# EAGLE schematic Z_sim_v2 (EAGLE 6.5.0)
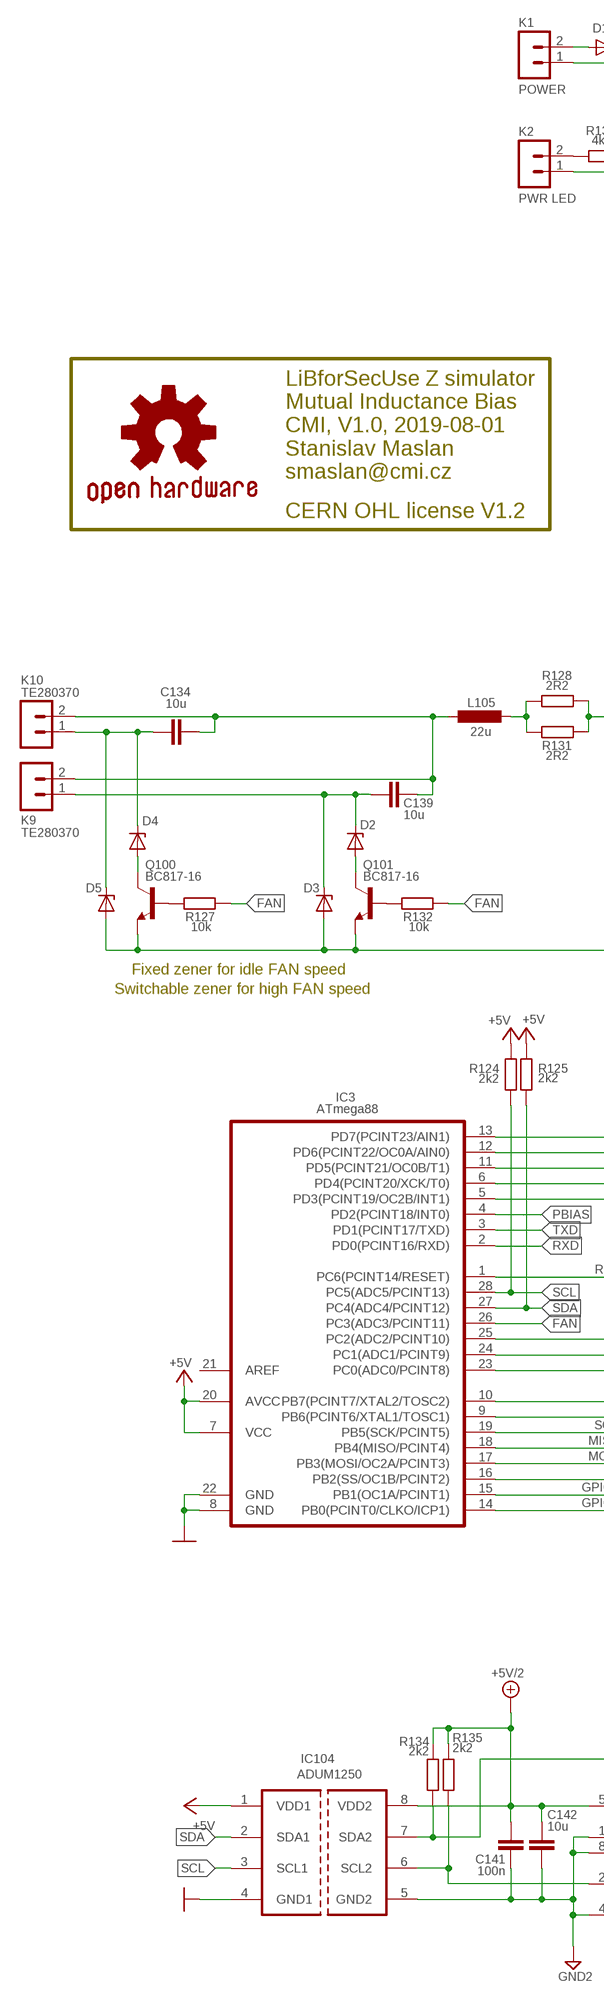
[diagram p0: schematic, sheet 1, part 1 of 2]
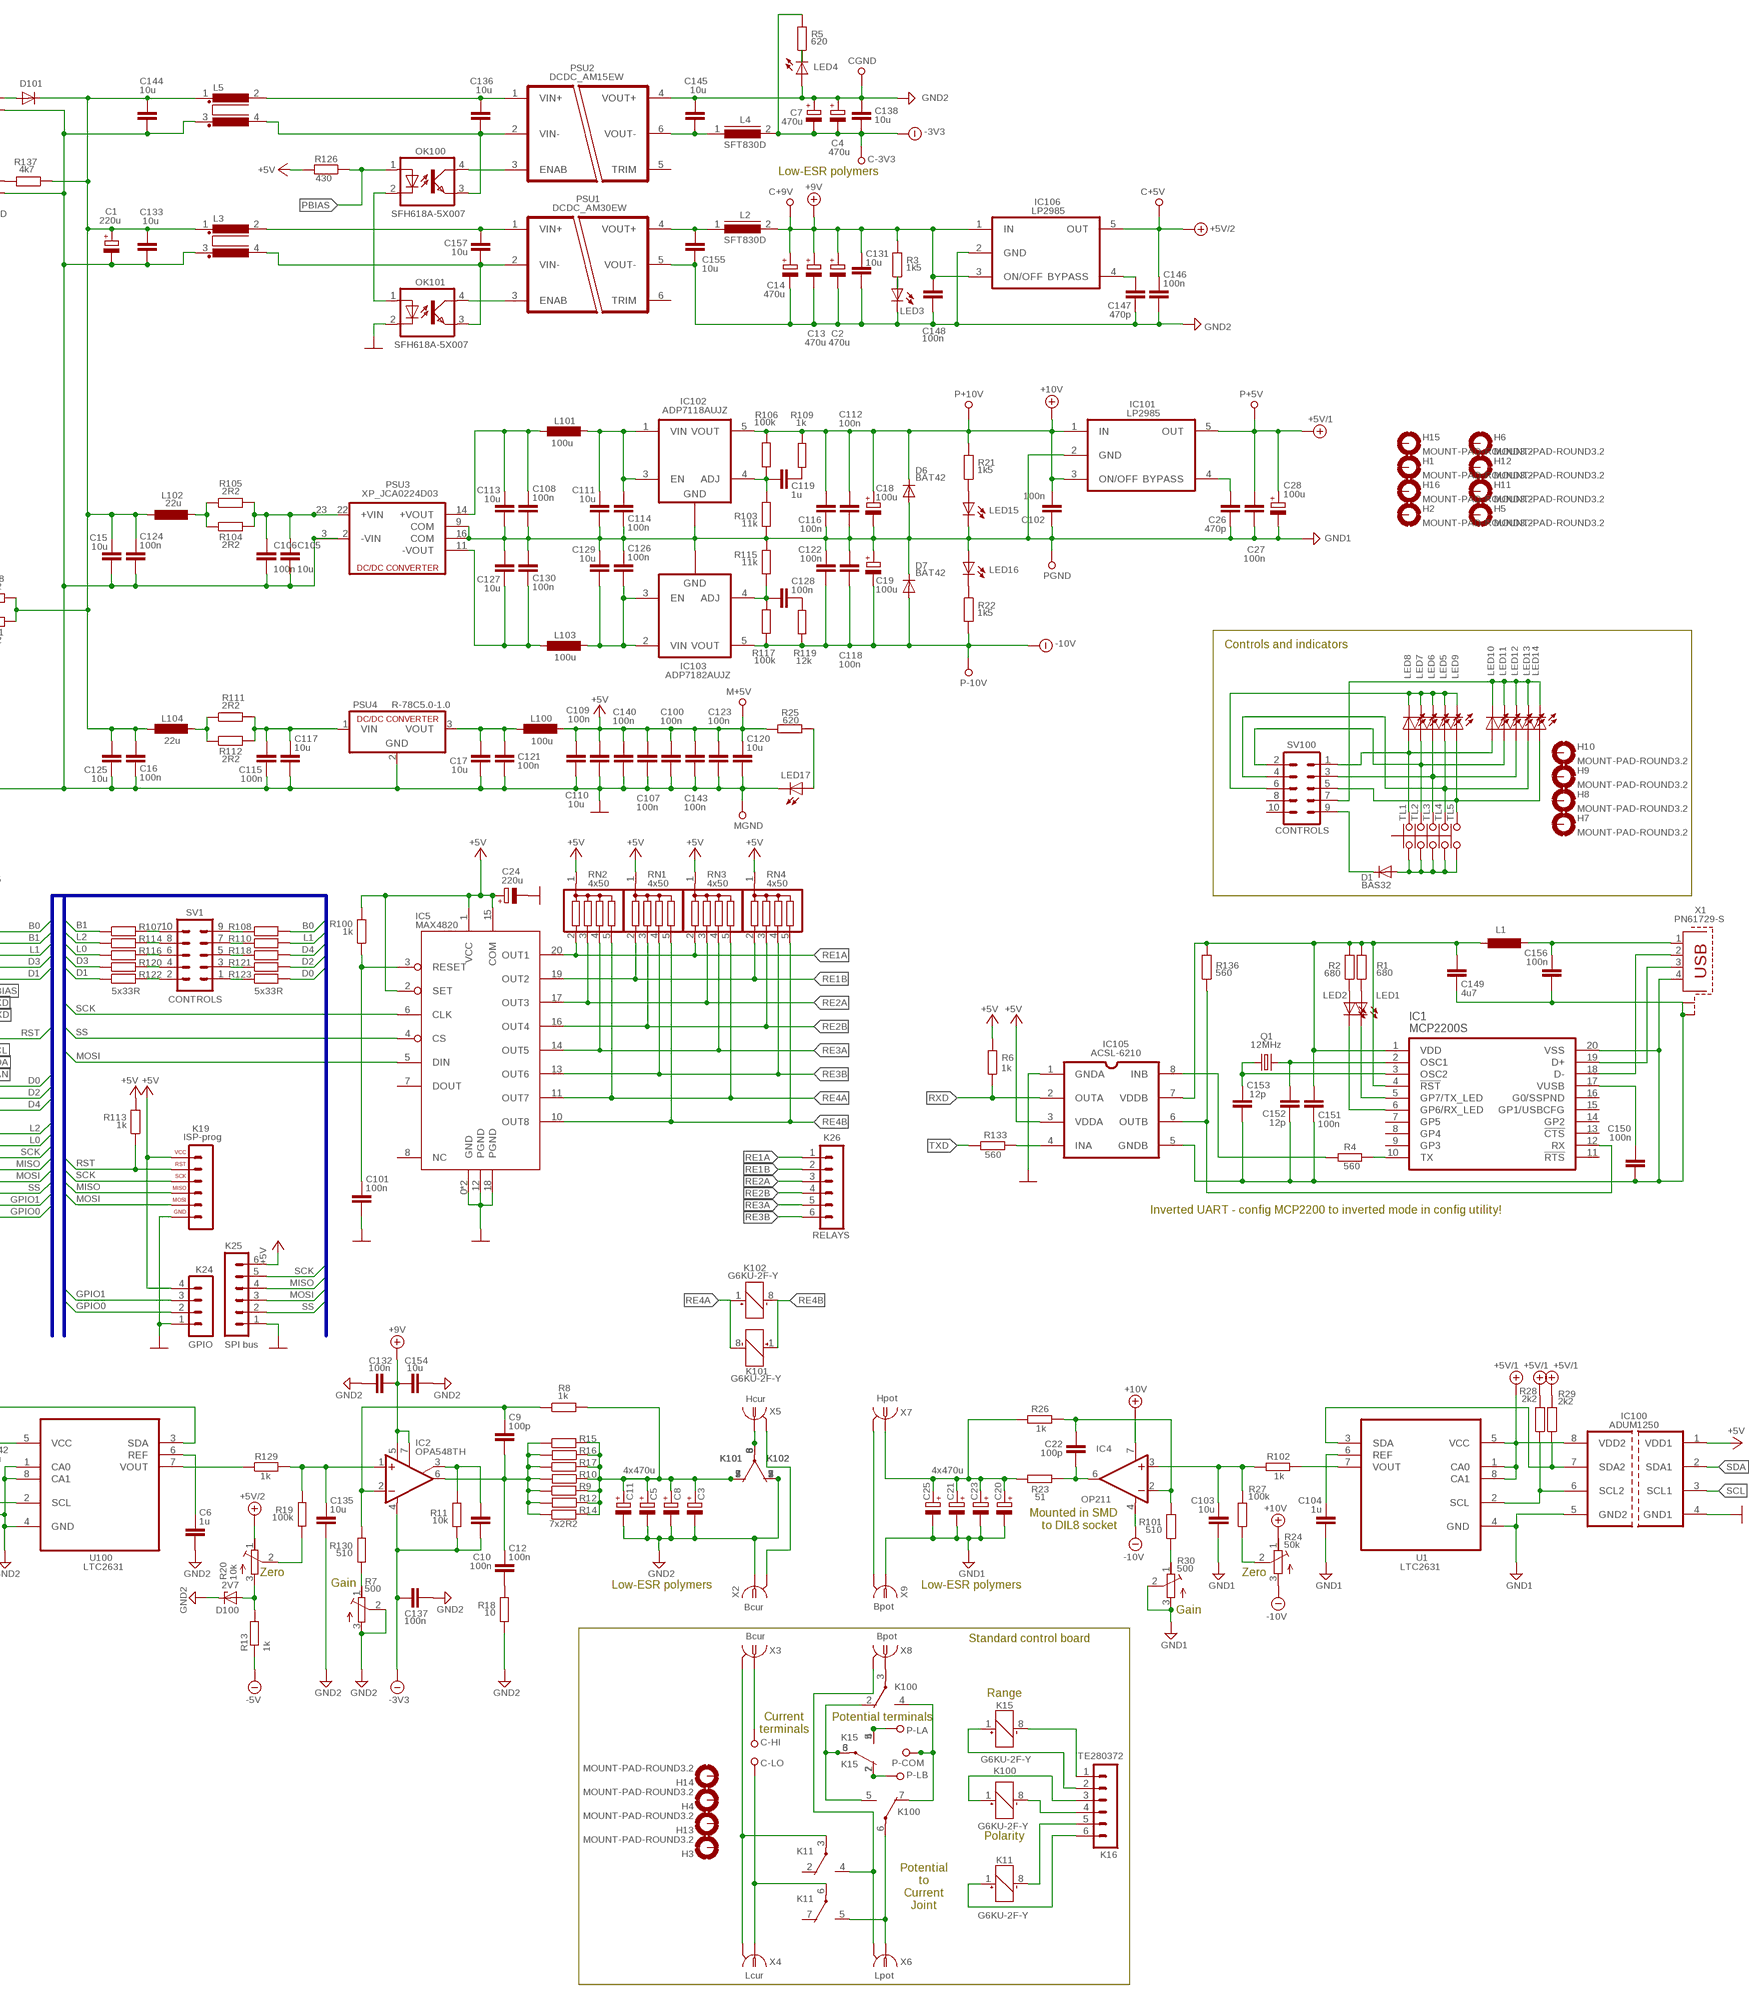
[diagram p1: schematic, sheet 1, part 2 of 2]

## Parts
C1  220u  CPOL-EUE3.5-8  [E3,5-8]
C2  470u  CPOL-EUE3.5-8  [E3,5-8]
C3  CPOL-EUE3.5-8  [E3,5-8]
C4  470u  CPOL-EUE3.5-8  [E3,5-8]
C5  CPOL-EUE3.5-8  [E3,5-8]
C6  1u  C-EUX0805  [X0805]
C7  470u  CPOL-EUE3.5-8  [E3,5-8]
C8  CPOL-EUE3.5-8  [E3,5-8]
C9  100p  C-EU025-024X044  [C025-024X044]
C10  100n  C-EUX0805  [X0805]
C11  4x470u  CPOL-EUE3.5-8  [E3,5-8]
C12  100n  C-EU050-024X044  [C050-024X044]
C13  470u  CPOL-EUE3.5-8  [E3,5-8]
C14  470u  CPOL-EUE3.5-8  [E3,5-8]
C15  10u  C-EUC1210K  [C1210K]
C16  100n  C-EUX0805  [X0805]
C17  10u  C-EUC1210K  [C1210K]
C18  100u  CPOL-EUE2.5-6  [E2,5-6]
C19  100u  CPOL-EUE2.5-6  [E2,5-6]
C20  CPOL-EUE3.5-8  [E3,5-8]
C21  CPOL-EUE3.5-8  [E3,5-8]
C22  100p  C-EU025-024X044  [C025-024X044]
C23  CPOL-EUE3.5-8  [E3,5-8]
C24  220u  CPOL-EUE3.5-8  [E3,5-8]
C25  4x470u  CPOL-EUE3.5-8  [E3,5-8]
C26  470p  C-EUX0805  [X0805]
C27  100n  C-EUX0805  [X0805]
C28  100u  CPOL-EUE2.5-6  [E2,5-6]
C100  100n  C-EUX0805  [X0805]
C101  100n  C-EUX0805  [X0805]
C102  100n  C-EUX0805  [X0805]
C103  10u  C-EUC1210K  [C1210K]
C104  1u  C-EUX0805  [X0805]
C105  10u  C-EUC1210K  [C1210K]
C106  100n  C-EUX0805  [X0805]
C107  100n  C-EUX0805  [X0805]
C108  100n  C-EUX0805  [X0805]
C109  100n  C-EUX0805  [X0805]
C110  10u  C-EUC1210K  [C1210K]
C111  10u  C-EUC1210K  [C1210K]
C112  100n  C-EUX0805  [X0805]
C113  10u  C-EUC1210K  [C1210K]
C114  100n  C-EUX0805  [X0805]
C115  100n  C-EUX0805  [X0805]
C116  100n  C-EUX0805  [X0805]
C117  10u  C-EUC1210K  [C1210K]
C118  100n  C-EUX0805  [X0805]
C119  1u  C-EUX0805  [X0805]
C120  10u  C-EUC1210K  [C1210K]
C121  100n  C-EUX0805  [X0805]
C122  100n  C-EUX0805  [X0805]
C123  100n  C-EUX0805  [X0805]
C124  100n  C-EUX0805  [X0805]
C125  10u  C-EUC1210K  [C1210K]
C126  100n  C-EUX0805  [X0805]
C127  10u  C-EUC1210K  [C1210K]
C128  100n  C-EUX0805  [X0805]
C129  10u  C-EUC1210K  [C1210K]
C130  100n  C-EUX0805  [X0805]
C131  10u  C-EUC1210K  [C1210K]
C132  100n  C-EUX0805  [X0805]
C133  10u  C-EUC1210K  [C1210K]
C134  10u  C-EUC1210K  [C1210K]
C135  10u  C-EUC1210K  [C1210K]
C136  10u  C-EUC1210K  [C1210K]
C137  100n  C-EUX0805  [X0805]
C138  10u  C-EUC1210K  [C1210K]
C139  10u  C-EUC1210K  [C1210K]
C140  100n  C-EUX0805  [X0805]
C141  100n  C-EUX0805  [X0805]
C142  10u  C-EUC1210K  [C1210K]
C143  100n  C-EUX0805  [X0805]
C144  10u  C-EUC1210K  [C1210K]
C145  10u  C-EUC1210K  [C1210K]
C146  100n  C-EUX0805  [X0805]
C147  470p  C-EUX0805  [X0805]
C148  100n  C-EUX0805  [X0805]
C149  4u7  C-EUC1210K  [C1210K]
C150  100n  C0805  [X0805]
C151  100n  C0805  [X0805]
C152  12p  C0805  [X0805]
C153  12p  C0805  [X0805]
C154  10u  C-EUC1210K  [C1210K]
C155  10u  C-EUC1210K  [C1210K]
C156  100n  C0805  [X0805]
C157  10u  C-EUC1210K  [C1210K]
C+5V  SPL  [SP]
C+9V  SPL  [SP]
C-3V3  SPL  [SP]
C-HI  FAST28R  [FAST28_R]
C-LO  FAST28R  [FAST28_R]
CGND  SPL  [SP]
D1  BAS32  [SOD80C]
D2  ZENER-DIODEZD-2.5  [ZDIO-2.5]
D3  ZENER-DIODEZD-2.5  [ZDIO-2.5]
D4  ZENER-DIODEZD-2.5  [ZDIO-2.5]
D5  ZENER-DIODEZD-2.5  [ZDIO-2.5]
D6  BAT42  DIODE-SOD80C  [SOD80C]
D7  BAT42  DIODE-SOD80C  [SOD80C]
D100  2V7  ZENER-DIODESOD80C  [SOD80C]
D101  DIODE-MELF-MLL41  [MELF-MLL41]
GOLD_ORB_SM1  OSHWLOGO_GOLD_ORB_MED  [OSHW1]
H1  MOUNT-PAD-ROUND3.2  [3,2-PAD]
H2  MOUNT-PAD-ROUND3.2  [3,2-PAD]
H3  MOUNT-PAD-ROUND3.2  [3,2-PAD]
H4  MOUNT-PAD-ROUND3.2  [3,2-PAD]
H5  MOUNT-PAD-ROUND3.2  [3,2-PAD]
H6  MOUNT-PAD-ROUND3.2  [3,2-PAD]
H7  MOUNT-PAD-ROUND3.2  [3,2-PAD]
H8  MOUNT-PAD-ROUND3.2  [3,2-PAD]
H9  MOUNT-PAD-ROUND3.2  [3,2-PAD]
H10  MOUNT-PAD-ROUND3.2  [3,2-PAD]
H11  MOUNT-PAD-ROUND3.2  [3,2-PAD]
H12  MOUNT-PAD-ROUND3.2  [3,2-PAD]
H13  MOUNT-PAD-ROUND3.2  [3,2-PAD]
H14  MOUNT-PAD-ROUND3.2  [3,2-PAD]
H15  MOUNT-PAD-ROUND3.2  [3,2-PAD]
H16  MOUNT-PAD-ROUND3.2  [3,2-PAD]
IC1  MCP2200S  [SOIC20W]
IC2  OPA548TH  [TO220-7H]
IC3  ATmega88  ATMEGA88P  [DIL28]
IC4  OP211  OPA650P  [DIL08]
IC5  MAX4820  MAX4820_TSSOP  [TSSOP20]
IC100  ADUM1250  [SO8]
IC101  LP2985  [SOT23-5]
IC102  ADP7118AUJZ  [SOT23-5]
IC103  ADP7182AUJZ  [SOT23-5]
IC104  ADUM1250  [SO8]
IC105  ACSL-6210  [SO8]
IC106  LP2985  [SOT23-5]
K1  POWER  TE280370  [TE280370]
K2  PWR LED  TE280370  [TE280370]
K9  TE280370  [TE280370]
K10  TE280370  [TE280370]
K11  G6KU-2F-Y  [G6KU-2F-Y]
K15  G6KU-2F-Y  [G6KU-2F-Y]
K16  TE280372  [TE280372]
K19  ISP-prog  AVR_SPI  [SIL6]
K24  GPIO  TE280371  [TE280371]
K25  SPI bus  TE280372  [TE280372]
K26  RELAYS  TE280372  [TE280372]
K100  G6KU-2F-Y  [G6KU-2F-Y]
K101  G6KU-2F-Y  [G6KU-2F-Y]
K102  G6KU-2F-Y  [G6KU-2F-Y]
L1  L-EU0204/5  [0204/5]
L2  SFT830D  [SFT830D]
L3  R1405UB1/2  [B1/2]
L4  SFT830D  [SFT830D]
L5  R1405UB1/2  [B1/2]
L100  100u  L-EUL1812  [L1812]
L101  100u  L-EUL1812  [L1812]
L102  22u  L-EUL1812  [L1812]
L103  100u  L-EUL1812  [L1812]
L104  22u  L-EUL1812  [L1812]
L105  22u  L-EUL1812  [L1812]
LED1  LEDCHIP-LED0603  [CHIP-LED0603]
LED2  LEDCHIP-LED0603  [CHIP-LED0603]
LED3  LEDCHIP-LED0603  [CHIP-LED0603]
LED4  LEDCHIP-LED0603  [CHIP-LED0603]
LED5  LED3MM  [LED3MM]
LED6  LED3MM  [LED3MM]
LED7  LED3MM  [LED3MM]
LED8  LED3MM  [LED3MM]
LED9  LED3MM  [LED3MM]
LED10  LED3MM  [LED3MM]
LED11  LED3MM  [LED3MM]
LED12  LED3MM  [LED3MM]
LED13  LED3MM  [LED3MM]
LED14  LED3MM  [LED3MM]
LED15  LEDCHIP-LED0603  [CHIP-LED0603]
LED16  LEDCHIP-LED0603  [CHIP-LED0603]
LED17  LEDCHIP-LED0603  [CHIP-LED0603]
M+5V  SPL  [SP]
MGND  SPL  [SP]
OK100  SFH618A-5X007  [SMD4-7]
OK101  SFH618A-5X007  [SMD4-7]
P+5V  SPL  [SP]
P+10V  SPL  [SP]
P-10V  SPL  [SP]
P-COM  FAST28R  [FAST28_R]
P-LA  FAST28R  [FAST28_R]
P-LB  FAST28R  [FAST28_R]
PGND  SPL  [SP]
PSU1  DCDC_AM30EW  [DCDC_AM30EW]
PSU2  DCDC_AM15EW  [DCDC_AM15EW]
PSU3  XP_JCA0224D03  [DCDC_XP_JCA_SYMOUT]
PSU4  R-78C5.0-1.0  [SIP3]
Q1  12MHz  CRYSTALHC49S  [HC49/S]
Q100  BC817-16  BC817-16LT1SMD  [SOT23-BEC]
Q101  BC817-16  BC817-16LT1SMD  [SOT23-BEC]
R1  680  R0805  [X0805]
R2  680  R0805  [X0805]
R3  1k5  R0805  [X0805]
R4  560  R0805  [X0805]
R5  620  R0805  [X0805]
R6  1k  R0805  [X0805]
R7  500  R-TRIMMT93YB  [RTRIMT93YB]
R8  1k  R-EU_0207/2V  [0207/2V]
R9  R-EU_0207/2V  [0207/2V]
R10  R-EU_0207/2V  [0207/2V]
R11  10k  R-EU_X0805  [X0805]
R12  7x2R2  R-EU_0207/2V  [0207/2V]
R13  1k  R-EU_X0805  [X0805]
R14  R-EU_0207/2V  [0207/2V]
R15  R-EU_0207/2V  [0207/2V]
R16  R-EU_0207/2V  [0207/2V]
R17  R-EU_0207/2V  [0207/2V]
R18  10  R-EU_0207/2V  [0207/2V]
R19  100k  R-EU_0204/2V  [0204V]
R20  10k  R-TRIMMT93YB  [RTRIMT93YB]
R21  1k5  R0805  [X0805]
R22  1k5  R0805  [X0805]
R23  51  R-EU_0207/2V  [0207/2V]
R24  50k  R-TRIMMT93YB  [RTRIMT93YB]
R25  620  R0805  [X0805]
R26  1k  R-EU_0207/2V  [0207/2V]
R27  100k  R-EU_0204/2V  [0204V]
R28  2k2  R-EU_X0805  [X0805]
R29  2k2  R-EU_X0805  [X0805]
R30  500  R-TRIMMT93YB  [RTRIMT93YB]
R100  1k  R0805  [X0805]
R101  510  R-EU_X0805  [X0805]
R102  1k  R-EU_X0805  [X0805]
R103  11k  R-EU_X0805  [X0805]
R104  2R2  R-EU_X0805  [X0805]
R105  2R2  R-EU_X0805  [X0805]
R106  100k  R-EU_X0805  [X0805]
R107  5x33R  R-EU_X0805  [X0805]
R108  R-EU_X0805  [X0805]
R109  1k  R-EU_X0805  [X0805]
R110  R-EU_X0805  [X0805]
R111  2R2  R-EU_X0805  [X0805]
R112  2R2  R-EU_X0805  [X0805]
R113  1k  R0805  [X0805]
R114  R-EU_X0805  [X0805]
R115  11k  R-EU_X0805  [X0805]
R116  R-EU_X0805  [X0805]
R117  100k  R-EU_X0805  [X0805]
R118  R-EU_X0805  [X0805]
R119  12k  R-EU_X0805  [X0805]
R120  R-EU_X0805  [X0805]
R121  R-EU_X0805  [X0805]
R122  R-EU_X0805  [X0805]
R123  5x33R  R-EU_X0805  [X0805]
R124  2k2  R0805  [X0805]
R125  2k2  R0805  [X0805]
R126  430  R-EU_X0805  [X0805]
R127  10k  R0805  [X0805]
R128  2R2  R-EU_X0805  [X0805]
R129  1k  R-EU_X0805  [X0805]
R130  510  R-EU_X0805  [X0805]
R131  2R2  R-EU_X0805  [X0805]
R132  10k  R0805  [X0805]
R133  560  R0805  [X0805]
R134  2k2  R-EU_X0805  [X0805]
R135  2k2  R-EU_X0805  [X0805]
R136  560  R0805  [X0805]
R137  4k7  R-EU_X0805  [X0805]
RN1  4x50  G04R  [SIL5]
RN2  4x50  G04R  [SIL5]
RN3  4x50  G04R  [SIL5]
RN4  4x50  G04R  [SIL5]
SV1  CONTROLS  ML10  [ML10]
SV100  CONTROLS  ML10  [ML10]
TL1  CUDL1_A  [CUDL1]
TL2  CUDL1_A  [CUDL1]
TL3  CUDL1_A  [CUDL1]
TL4  CUDL1_A  [CUDL1]
TL5  CUDL1_A  [CUDL1]
U1  LTC2631  LTC2631AITS8-LZ12PBF  [SOT65P280X100-8N]
U100  LTC2631  LTC2631AITS8-LZ12PBF  [SOT65P280X100-8N]
X1  PN61729-S  [PN61729-S]
X2  Bcur  A1944-50  [A1944]
X3  Bcur  A1944-50  [A1944]
X4  Lcur  A1944-50  [A1944]
X5  Hcur  A1944-50  [A1944]
X6  Lpot  A1944-50  [A1944]
X7  Hpot  A1944-50  [A1944]
X8  Bpot  A1944-50  [A1944]
X9  Bpot  A1944-50  [A1944]

## Nets
+5V [zsim]: C24.+ C100.P$1 C107.P$1 C109.P$1 C110.1 C120.1 C123.P$1 C140.P$1 C143.P$1 IC3.7(VCC) IC3.20(AVCC) IC5.1(VCC) IC5.2(SET) IC5.15(COM) IC100.1(VDD1) IC104.1(VDD1) IC105.3(VDDA) K19.6 K24.4 K25.6 L100.2 M+5V.1 R6.P$2 R25.P$2 R100.P$2 R113.P$2 R124.P$2 R125.P$2 R126.P$2 RN1.1 RN2.1 RN3.1 RN4.1
+5V/1 [zsim]: C27.P$2 C28.+ IC100.8(VDD2) IC101.5(OUT) P+5V.1 R28.P$2 R29.P$2 U1.1(CA0) U1.5(VCC) U1.8(CA1)
+5V/2 [zsim]: C141.P$1 C142.1 C146.P$2 C+5V.1 IC104.8(VDD2) IC106.5(OUT) R20.1(E) R134.P$2 R135.P$2 U100.5(VCC)
+9V [zsim]: C2.+ C13.+ C14.+ C131.1 C132.P$2 C148.P$2 C154.1 C+9V.1 IC2.5(V+) IC2.7(E/S) IC106.1(IN) IC106.3(ON/OFF) L2.2 R3.P$2
+10V [zsim]: C18.+ C102.P$2 C112.P$1 C116.P$1 D6.C IC4.7(V+) IC101.1(IN) IC101.3(ON/OFF) IC102.5(VOUT) P+10V.1 R21.P$2 R24.1(E) R106.P$2 R109.P$1
-5V [zsim]: C4.- C7.- C10.P$2 C137.P$1 C138.2 C-3V3.1 IC2.4(V-) L4.2 R5.P$2 R11.P$2 R13.P$1 ; supply symbol labelled -3V3
-10V [zsim]: C19.- C118.P$2 C122.P$2 D7.A IC4.4(V-) IC103.5(VOUT) P-10V.1 R22.P$2 R24.3(A) R117.P$1 R119.P$2
B0 [zsim]: IC3.13(PD7(PCINT23/AIN1)) R108.P$2
B1 [zsim]: IC3.12(PD6(PCINT22/OC0A/AIN0)) R107.P$1
D0 [zsim]: IC3.25(PC2(ADC2/PCINT10)) R123.P$2
D1 [zsim]: IC3.5(PD3(PCINT19/OC2B/INT1)) R122.P$1
D2 [zsim]: IC3.24(PC1(ADC1/PCINT9)) R121.P$2
D3 [zsim]: IC3.6(PD4(PCINT20/XCK/T0)) R120.P$1
D4 [zsim]: IC3.23(PC0(ADC0/PCINT8)) R118.P$2
FAN [zsim]: IC3.26(PC3(ADC3/PCINT11)) R127.P$1 R132.P$1
GND [zsim]: C1.- C15.2 C16.P$2 C17.2 C24.- C100.P$2 C101.P$2 C105.2 C106.P$2 C107.P$2 C109.P$2 C110.2 C115.P$2 C117.2 C120.2 C121.P$2 C123.P$2 C124.P$2 C125.2 C133.2 C140.P$2 C143.P$2 C144.2 D3.A D5.A IC3.8(GND) IC3.22(GND) IC5.0(GND) IC5.9(GND) IC5.12(PGND) IC5.18(PGND) IC100.4(GND1) IC104.4(GND1) IC105.1(GNDA) K1.1 K2.1 K19.1 K24.1 K25.1 L3.3 L5.3 LED17.C MGND.1 OK101.2(C) PSU3.2(-VIN) PSU3.3(-VIN1) PSU4.2(GND) Q100.E Q101.E
GND1 [zsim]: C18.- C19.+ C20.- C21.- C23.- C25.- C26.P$2 C27.P$1 C28.- C102.P$1 C103.2 C104.P$2 C108.P$2 C111.2 C112.P$2 C113.2 C114.P$2 C116.P$2 C118.P$1 C122.P$1 C126.P$1 C127.1 C129.1 C130.P$1 D6.A D7.C IC100.5(GND2) IC101.2(GND) IC102.2(GND) IC103.1(GND) LED15.C LED16.A PGND.1 PSU3.9(COM) PSU3.16(COM) R30.2(S) R30.3(A) R103.P$1 R115.P$2 U1.4(GND) X9.1
GND2 [zsim]: C2.- C3.- C4.+ C5.- C6.P$2 C7.+ C8.- C11.- C13.- C14.- C131.2 C132.P$1 C135.2 C137.P$2 C138.1 C141.P$2 C142.2 C145.1 C146.P$1 C147.P$2 C148.P$1 C154.2 C155.2 CGND.1 D100.C IC104.5(GND2) IC106.2(GND) K101.4(2:S) K101.5(3:S) K102.2(2:O) K102.7(3:O) LED3.C LED4.A PSU1.5(VOUT-) PSU2.4(VOUT+) R7.2(S) R7.3(A) R18.1 U100.1(CA0) U100.4(GND) U100.8(CA1) X2.1
GPIO0 [zsim]: IC3.14(PB0(PCINT0/CLKO/ICP1)) K24.2
GPIO1 [zsim]: IC3.15(PB1(OC1A/PCINT1)) K24.3
L0 [zsim]: IC3.9(PB6(PCINT6/XTAL1/TOSC1)) R116.P$1
L1 [zsim]: IC3.11(PD5(PCINT21/OC0B/T1)) R110.P$2
L2 [zsim]: IC3.10(PB7(PCINT7/XTAL2/TOSC2)) R114.P$1
MISO [zsim]: IC3.18(PB4(MISO/PCINT4)) K19.3 K25.4
MOSI [zsim]: IC3.17(PB3(MOSI/OC2A/PCINT3)) IC5.5(DIN) K19.2 K25.3
N$1 [zsim]: C10.P$1 IC2.3(ILIM) R11.P$1
N$2 [sup24v]: OK100.4(COL) PSU2.3(ENAB)
N$3 [zsim]: C135.1 IC2.1(+IN) R19.2 R129.P$2
N$4 [sup24v]: C136.1 L5.2 PSU2.1(VIN+)
N$5 [zsim]: R19.1 R20.2(S)
N$6 [zsim]: C3.+ C5.+ C8.+ C11.+ K101.2(2:O) K101.7(3:O) K102.4(2:S) K102.5(3:S) R8.2 R9.2 R10.1 R12.2 R14.1 R15.2 R16.1 R17.2
N$7 [zsim]: C12.2 R18.2
N$8 [sup24v]: C136.2 L5.4 OK100.3(EMIT) PSU2.2(VIN-)
N$9 [zsim]: R129.P$1 U100.7(VOUT)
N$10 [zsim]: C9.1 IC2.2(-IN) R8.1 R130.P$2
N$11 [zsim]: R7.1(E) R130.P$1
N$12 [zsim]: D100.A R13.P$2 R20.3(A)
N$13 [sup24v]: C157.1 L3.2 PSU1.1(VIN+)
N$14 [sup24v]: C157.2 L3.4 OK101.3(EMIT) PSU1.2(VIN-)
N$15 [zsim]: K101.3(2:P) K101.6(3:P) K102.3(2:P) K102.6(3:P) X5.1
N$16 [zsim]: C147.P$1 IC106.4(BYPASS)
N$17 [zsim]: IC105.4(INA) R133.P$2
N$18 [sup24v]: OK101.4(COL) PSU1.3(ENAB)
N$19 [zsim]: OK100.2(C) OK101.1(A)
N$20 [zsim]: C6.P$1 U100.6(REF)
N$21 [sup24v]: C139.1 D2.C D3.C K9.1
N$22 [zsim]: C111.1 C114.P$1 IC102.1(VIN) IC102.3(EN) L101.2
N$23 [zsim]: IC104.6(SCL2) R135.P$1 U100.2(SCL)
N$24 [zsim]: IC104.7(SDA2) R134.P$1 U100.3(SDA)
N$25 [zsim]: C103.1 IC4.3(+IN) R27.2 R102.P$2
N$26 [zsim]: R24.2(S) R27.1
N$27 [zsim]: R102.P$1 U1.7(VOUT)
N$28 [zsim]: C22.2 IC4.6(OUT) R23.1
N$29 [zsim]: C104.P$1 U1.6(REF)
N$30 [zsim]: IC100.6(SCL2) R28.P$1 U1.2(SCL)
N$31 [zsim]: IC100.7(SDA2) R29.P$1 U1.3(SDA)
N$32 [zsim]: C126.P$2 C129.2 IC103.2(VIN) IC103.3(EN) L103.2
N$33 [zsim]: C127.2 C130.P$2 L103.1 PSU3.11(-VOUT)
N$34 [zsim]: C108.P$1 C113.1 L101.1 PSU3.14(+VOUT)
N$35 [zsim]: C20.+ C21.+ C23.+ C25.+ R23.2 R26.2 X7.1
N$36 [zsim]: C128.P$2 IC103.4(ADJ) R115.P$1 R117.P$2
N$37 [zsim]: C128.P$1 R119.P$1
N$38 [zsim]: C119.P$2 IC102.4(ADJ) R103.P$2 R106.P$1
N$39 [zsim]: C119.P$1 R109.P$2
N$40 [zsim]: D2.A Q101.C
N$41 [zsim]: L102.2 R104.P$1 R105.P$1
N$42 [zsim]: C105.1 C106.P$1 PSU3.22(+VIN) PSU3.23(+VIN1) R104.P$2 R105.P$2
N$45 [zsim]: C22.1 IC4.2(-IN) R26.1 R101.P$2
N$46 [zsim]: R30.1(E) R101.P$1
N$47 [sup24v]: C134.1 D4.C D5.C K10.1
N$48 [zsim]: C26.P$1 IC101.4(BYPASS)
N$49 [zsim]: X7.2 X7.3 X7.4 X7.5 X9.2 X9.3 X9.4 X9.5
N$50 [zsim]: Q101.B R132.P$2
N$51 [sup24v]: C115.P$1 C117.1 PSU4.1(VIN) R111.P$2 R112.P$2
N$52 [sup24v]: D101.A K1.2
N$53 [sup24v]: L104.2 R111.P$1 R112.P$1
N$54 [zsim]: C9.2 C12.1 IC2.6(OUT) R9.1 R10.2 R12.1 R14.2 R15.1 R16.2 R17.1
N$55 [zsim]: C17.1 C121.P$1 L100.1 PSU4.3(VOUT)
N$56 [zsim]: X2.2 X2.3 X2.4 X2.5 X5.2 X5.3 X5.4 X5.5
N$57 [zsim]: C101.P$1 IC5.3(RESET) R100.P$1
N$58 [zsim]: D4.A Q100.C
N$59 [zsim]: Q100.B R127.P$2
N$60 [zsim]: K2.2 R137.P$2
N$61 [zsim]: R122.P$2 SV1.2
N$62 [zsim]: R120.P$2 SV1.4
N$63 [zsim]: C152.P$2 IC1.2(OSC1) Q1.2
N$64 [zsim]: C153.P$2 IC1.3(OSC2) Q1.1
N$65 [zsim]: C156.P$2 L1.1 X1.1
N$66 [zsim]: R123.P$1 SV1.1
N$67 [zsim]: R121.P$1 SV1.3
N$68 [zsim]: IC1.18(D-) X1.2
N$69 [zsim]: IC1.19(D+) X1.3
N$70 [zsim]: C150.P$2 IC1.17(VUSB)
N$71 [zsim]: C149.1 C151.P$2 IC1.1(VDD) IC1.4(!RST) IC105.7(VDDB) L1.2 R1.P$2 R2.P$2 R136.P$2
N$72 [zsim]: LED1.A R1.P$1
N$73 [zsim]: LED2.A R2.P$1
N$74 [zsim]: IC1.5(GP7/TX_LED) LED1.C
N$75 [zsim]: IC1.6(GP6/RX_LED) LED2.C
N$76 [zsim]: IC1.12(RX) IC105.6(OUTB) R136.P$1
N$77 [zsim]: R118.P$1 SV1.5
N$78 [zsim]: IC1.10(TX) R4.P$2
N$79 [zsim]: IC105.8(INB) R4.P$1
N$80 [zsim]: C149.2 C150.P$1 C151.P$1 C152.P$1 C153.P$1 C156.P$1 IC1.20(VSS) IC105.5(GNDB) X1.4 X1.S1 X1.S2
N$81 [zsim]: R116.P$2 SV1.6
N$82 [zsim]: R114.P$2 SV1.8
N$83 [zsim]: R110.P$1 SV1.7
N$84 [zsim]: R107.P$2 SV1.10
N$85 [zsim]: R108.P$1 SV1.9
N$86 [zsim]: LED3.A R3.P$1
N$87 [zsim]: LED4.C R5.P$1
N$88 [zsim]: LED17.A R25.P$1
N$89 [zsim]: LED15.A R21.P$1
N$90 [zsim]: LED16.C R22.P$1
N$91 [zsim]: LED8.A LED10.A SV100.1 TL1.1
N$92 [zsim]: LED7.A LED11.A SV100.2 TL2.1
N$93 [zsim]: LED6.A LED12.A SV100.3 TL3.1
N$94 [zsim]: LED5.A LED13.A SV100.4 TL4.1
N$95 [zsim]: LED9.A LED14.A SV100.5 TL5.1
N$96 [zsim]: K15.2(2:O) K15.7(3:O) P-LB.P$1
N$97 [zsim]: K15.4(2:S) K15.5(3:S) P-LA.P$1
N$98 [zsim]: D1.A TL1.3 TL2.3 TL3.3 TL4.3 TL5.3
N$99 [zsim]: D1.C SV100.9
N$100 [zsim]: LED5.K(C) LED6.K(C) LED7.K(C) LED8.K(C) LED9.K(C) SV100.6
N$101 [zsim]: LED10.K(C) LED11.K(C) LED12.K(C) LED13.K(C) LED14.K(C) SV100.7
N$102 [zsim]: K15.3(2:P) K15.6(3:P) K100.2(2:O) K100.5(3:S)
N$103 [zsim]: K100.3(2:P) X8.1
N$104 [zsim]: K100.4(2:S) K100.7(3:O) P-COM.P$1
N$105 [zsim]: K16.4 K100.8(1:-)
N$106 [sup24v]: C134.2 C139.2 K9.2 K10.2 L105.1
N$107 [zsim]: K11.5(3:S) K100.6(3:P) X6.1
N$108 [zsim]: K11.4(2:S) X6.2 X6.3 X6.4 X6.5 X8.2 X8.3 X8.4 X8.5
N$109 [sup24v]: L105.2 R128.P$1 R131.P$1
N$110 [sup24v]: C1.+ C15.1 C16.P$1 C124.P$1 C125.1 C133.1 C144.1 D101.C L3.1 L5.1 L102.1 L104.1 R128.P$2 R131.P$2 R137.P$1
N$111 [zsim]: C-HI.P$1 X3.1
N$112 [zsim]: C-LO.P$1 K11.6(3:P) X4.1
N$113 [zsim]: K11.3(2:P) X3.2 X3.3 X3.4 X3.5 X4.2 X4.3 X4.4 X4.5
N$114 [zsim]: K15.1(1:+) K16.2
N$115 [zsim]: K15.8(1:-) K16.1
N$117 [zsim]: K16.3 K100.1(1:+)
N$118 [zsim]: K11.1(1:+) K16.6
N$119 [zsim]: K11.8(1:-) K16.5
PBIAS [zsim]: IC3.4(PD2(PCINT18/INT0)) OK100.1(A) R126.P$1
RE1A [zsim]: IC5.20(OUT1) K26.1 RN2.2 RN3.2
RE1B [zsim]: IC5.19(OUT2) K26.2 RN1.2 RN4.2
RE2A [zsim]: IC5.17(OUT3) K26.3 RN2.3 RN3.3
RE2B [zsim]: IC5.16(OUT4) K26.4 RN1.3 RN4.3
RE3A [zsim]: IC5.14(OUT5) K26.5 RN2.4 RN3.4
RE3B [zsim]: IC5.13(OUT6) K26.6 RN1.4 RN4.4
RE4A [zsim]: IC5.11(OUT7) K101.8(1:-) K102.1(1:+) RN2.5 RN3.5
RE4B [zsim]: IC5.10(OUT8) K101.1(1:+) K102.8(1:-) RN1.5 RN4.5
RST [zsim]: IC3.1(PC6(PCINT14/RESET)) K19.5 R113.P$1
RXD [zsim]: IC3.2(PD0(PCINT16/RXD)) IC105.2(OUTA) R6.P$1
SCK [zsim]: IC3.19(PB5(SCK/PCINT5)) IC5.6(CLK) K19.4 K25.5
SCL [zsim]: IC3.28(PC5(ADC5/PCINT13)) IC100.3(SCL1) IC104.3(SCL1) R124.P$1
SDA [zsim]: IC3.27(PC4(ADC4/PCINT12)) IC100.2(SDA1) IC104.2(SDA1) R125.P$1
SS [zsim]: IC3.16(PB2(SS/OC1B/PCINT2)) IC5.4(CS) K25.2
TXD [zsim]: IC3.3(PD1(PCINT17/TXD)) R133.P$1
VOUT+ [zsim]: C155.1 L2.1 PSU1.4(VOUT+)
VOUT- [zsim]: C145.2 L4.1 PSU2.6(VOUT-)
Unconnected: H1.B3,2(MOUNT) H2.B3,2(MOUNT) H3.B3,2(MOUNT) H4.B3,2(MOUNT) H5.B3,2(MOUNT) H6.B3,2(MOUNT) H7.B3,2(MOUNT) H8.B3,2(MOUNT) H9.B3,2(MOUNT) H10.B3,2(MOUNT) H11.B3,2(MOUNT) H12.B3,2(MOUNT) H13.B3,2(MOUNT) H14.B3,2(MOUNT) H15.B3,2(MOUNT) H16.B3,2(MOUNT) IC1.7(GP5) IC1.8(GP4) IC1.9(GP3) IC1.11(!RTS) IC1.13(!CTS) IC1.14(GP2) IC1.15(GP1/USBCFG) IC1.16(G0/SSPND) IC3.21(AREF) IC5.7(DOUT) IC5.8(NC) K11.2(2:O) K11.7(3:O) PSU1.6(TRIM) PSU2.5(TRIM) SV100.8 SV100.10

## Buses
SCK,MISO,MOSI,RST,SS,B[0..1],L[0..2],D[0..4],GPIO[0..1]

## Notes on the sheet
- Low-ESR polymers
- LiBforSecUse Z simulator
  Mutual Inductance Bias
  CMI, V1.0, 2019-08-01
  Stanislav Maslan
  smaslan@cmi.cz
- CERN OHL license V1.2
- Controls and indicators
- Fixed zener for idle FAN speed
- Switchable zener for high FAN speed
- Inverted UART - config MCP2200 to inverted mode in config utility!
- Mounted in SMD
  to DIL8 socket
- Zero | Zero
- Gain
- Low-ESR polymers | Low-ESR polymers
- Gain
- Standard control board
- Range
- Potential terminals
- Current
  terminals
- Polarity
- Potential
  to
  Current
  Joint

## Library data of the parts
C1-C5 C7 C8 C11 C13 C14 C18-C21 C23-C25 C28 = rcl:CPOL-EU: POLARIZED CAPACITOR, European symbol
C6 C9 C10 C12 C15-C17 C22 C26 C27 C100-C149 C154 C155 C157 = rcl:C-EU: CAPACITOR, European symbol
C150-C153 C156 = ostatni:C: C0805
C+5V C+9V C-3V3 CGND M+5V MGND P+5V P+10V P-10V PGND = piny:SP
C-HI C-LO P-COM P-LA P-LB = piny:FAST28
D1 = diode:BAS32: BAS32: High speed diode. trr = 4ns, Ur = 75V, If = 200mA.
D2-D5 D100 = diode:ZENER-DIODE: Z-Diode
D6 D7 D101 = diode:DIODE-: DIODE
GOLD_ORB_SM1 = bfl:OSHWLOGO: These are Open-Source Hardware logos.
H1-H16 = holes:MOUNT-PAD-ROUND: MOUNTING PAD, round
IC1 = mcp2200:MCP2200: USB to serial converter by micreochip
IC2 = burr-brown:OPA548: Operational Amplifier High-Voltage, High-Current
IC3 = ostatni:ATMEGA88
IC4 = burr-brown:OPA650: Operational Amplifier Wideband, Low Power, Voltage Feedback; OC_FARNELL: unknown; OC_NEWARK: unknown
IC5 = MAX4820:MAX4820: Relay driver.
IC100 IC104 = ostatni:ADUM1250: Bidirectional I2C isolator.
IC101 IC106 = ostatni:LP2985: LDO regulator.
IC102 = ostatni:ADP7118: Positive low noise LDO. Vin = 20V.
IC103 = ostatni:ADP7182: Negative low noise LDO. Vin = -28V.
IC105 = ostatni:ACSL-6210: Bidirectional optocoupler.
K1 K2 K9 K10 = piny:TE280370
K11 K15 K100-K102 = relay:G6K: Low Signal Relay oeiwcsnts1.omron.com/.. D20G6K0100.pdf; MF: OMRON COMPONENTS USA; MPN: G6KU-2F-Y DC3; OC_FARNELL: unknown; OC_NEWARK: 89C6496
K16 K25 K26 = piny:TE280372
K19 = ostatni:AVR_SPI: SPI rozhranni pro muj kua programator AVR.
K24 = piny:TE280371
L1 L100-L105 = rcl:L-EU: INDUCTOR, European symbol
L2 L4 = inductors:SFT830D: INDUCTOR
L3 L5 = inductor-nkl:R1405U: Gleichtakt-Entstördrossel (über typ. 5MHz) common mode choke (above typ.5MHz); OC_FARNELL: unknown; OC_NEWARK: unknown
LED1-LED17 = led:LED: LED OSRAM: - CHIPLED LG R971, LG N971, LY N971, LG Q971, LY Q971, LO R971, LY R971 LH N974, LH R974 LS Q976, LO Q976, LY Q976 LO Q996 - Hyper CHIPLED LW Q18S LB Q993, LB Q99A, LB R99A - SideLED LS A670, LO A670, LY A670, LG A670, LP A670 LB A673, LV A673, LT A673, LW A673 LH A674 LY A675 LS A676, LA A676, LO A676, LY A676, LW A676 LS A679, LY A679, LG A679 - Hyper Micro SIDELED® LS Y876, LA Y876, LO Y876, LY Y876 LT Y87S - SmartLED LW L88C, LW L88S LB L89C, LB L89S, LG L890 LS L89K, LO L89K, LY L89K LS L896, LA L896, LO L896, LY L896 - TOPLED LS T670, LO T670, LY T670, LG T670, LP T670 LSG T670, LSP T670, LSY T670, LOP T670, LYG T670 LG T671, LOG T671, LSG T671 LB T673, LV T673, LT T673, LW T673 LH T674 LS T676, LA T676, LO T676, LY T676, LB T676, LH T676, LSB T676, LW T676 LB T67C, LV T67C, LT T67C, LS T67K, LO T67K, LY T67K, LW E67C LS E67B, LA E67B, LO E67B, LY E67B, LB E67C, LV E67C, LT E67C LW T67C LS T679, LY T679, LG T679 LS T770, LO T770, LY T770, LG T770, LP T770 LB T773, LV T773, LT T773, LW T773 LH T774 LS E675, LA E675, LY E675, LS T675 LS T776, LA T776, LO T776, LY T776, LB T776 LHGB T686 LT T68C, LB T68C - Hyper Mini TOPLED® LB M676 - Mini TOPLED Santana® LG M470 LS M47K, LO M47K, LY M47K Source: http://www.osram.convergy.de LUXEON: - LUMILED® LXK2-PW12-R00, LXK2-PW12-S00, LXK2-PW14-U00, LXK2-PW14-V00 LXK2-PM12-R00, LXK2-PM12-S00, LXK2-PM14-U00 LXK2-PE12-Q00, LXK2-PE12-R00, LXK2-PE12-S00, LXK2-PE14-T00, LXK2-PE14-U00 LXK2-PB12-K00, LXK2-PB12-L00, LXK2-PB12-M00, LXK2-PB14-N00, LXK2-PB14-P00, LXK2-PB14-Q00 LXK2-PR12-L00, LXK2-PR12-M00, LXK2-PR14-Q00, LXK2-PR14-R00 LXK2-PD12-Q00, LXK2-PD12-R00, LXK2-PD12-S00 LXK2-PH12-R00, LXK2-PH12-S00 LXK2-PL12-P00, LXK2-PL12-Q00, LXK2-PL12-R00 Source: www.luxeon.com KINGBRIGHT: KA-3528ASYC Source: www.kingbright.com
OK100 OK101 = optocoupler:SFH618?*: Optocoupler, Phototransistor Output, Low Input Current Source: Data sheet <http://www.vishay.com/docs/83673/sfh618.pdf>; MPN: SFH618A-5X007; OC_FARNELL: unknown; OC_NEWARK: 43K9546
PSU1 = ostatni:DCDC_AM30EW: DC, 30W, trimmable output, 1500V isolation
PSU2 = ostatni:DCDC_AM15EW: Aimtec, DC-DC, 15W, trimmable output, enable input
PSU3 = civky_trafa:XP_JCA0224D03: XP DC-DC converter, symetrical output.
PSU4 = dc-dc-converter:R-78C*-1.0: INNOLINE DC/DC-Converter 1.0 AMP SIP3 Single Output Source: Data sheet <http://www.mikrocontroller.net/attachment/150645/157764-da-01-en-DC_DC_WANDLER_R_78C5_0_1_0.pdf>
Q1 = crystal:CRYSTAL: CRYSTAL; OC_FARNELL: 1667008; OC_NEWARK: unknown
Q100 Q101 = transistor-npn:BC817*: NPN Transistor
R1-R6 R21 R22 R25 R100 R113 R124 R125 R127 R132 R133 R136 = ostatni:R: R0805
R7 R20 R24 R30 = rcl:R-TRIMM: Trimm resistor
R8-R19 R23 R26-R29 R101-R112 R114-R123 R126 R128-R131 R134 R135 R137 = rcl:R-EU_: RESISTOR, European symbol
RN1-RN4 = resistor-sil:G04R: SIL RESISTOR; OC_FARNELL: unknown; OC_NEWARK: unknown
SV1 SV100 = con-ml:ML10: HARTING; OC_FARNELL: unknown; OC_NEWARK: unknown
TL1-TL5 = butony:CUDL1
U1 U100 = LTC_By_element14_Batch_1:LTC2631AITS8-LZ12PBF: DAC with 10ppm/°C Reference; MPN: LTC2631AITS8-LZ12#PBF; OC_FARNELL: -; OC_NEWARK: 15R0163; PACKAGE: TSOT-23-8; SUPPLIER: Linear Technology
X1 = con-berg:PN61729-S: BERG USB connector; OC_FARNELL: unknown; OC_NEWARK: unknown
X2-X9 = con-coax:A1944-50: BNC CONNECTOR 50 Ohm distributor Buerklin 78F2475; OC_FARNELL: unknown; OC_NEWARK: unknown

## Net classes
0 default: clearance 0.305 mm
2 sup24v: clearance 0.457 mm
3 zsim: clearance 0.305 mm